# Altium schematic sheet Sheet1.SchDoc
size A4; SheetNumber: 1; SheetTotal: 1
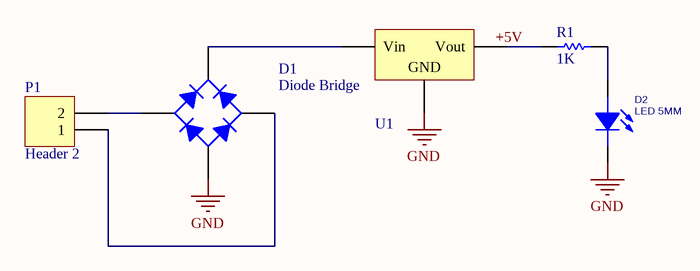
[diagram p0: Sheet1.SchDoc]

## Parts
D1  Diode Bridge  [Bridge KBP PACKAGE]
D2  LED 5MM  [LED5MM_BLUE]
P1  Header 2  [HDR1X2]
R1  1K  [Axial 0_25 W, 0_4 IN LEAD PITCH]
U1  L7805CV  [TO-220 AB]  (value not drawn)

## Nets
GND: D1.4(-) D2.2(CATHODE) U1.2(GND)
+5V: R1.2 U1.3(Vout)
NetD1_1: D1.1(+) U1.1(Vin)
NetD1_2: D1.2(AC) P1.2
NetD1_3: D1.3(AC) P1.1
NetD2_1: D2.1(ANODE) R1.1

## Library data of the parts
D1 = Diode Bridge TOTAL SIZE: Full Wave Diode Bridge; Designer: Abbas Basereh; Design Date: 1395/11/09; ComponentLink1Description: Datasheet; ComponentLink2Description: Reference; Mounting Technology: Surface Mount\Through-Hole; Status: Unreleased
D2 = LED 5MM: Light Emitting Diode; Designer: Abbas Basereh; Data: 16-12-2016; Link: *; Part.No: *
P1 = Header 2: Header, 2-Pin; LatestRevisionDate: 17-Jul-2002; LatestRevisionNote: Re-released for DXP Platform.; Publisher: Altium Limited
R1 = RES Axial 0.25W: Designer: Abbas Basereh; Desc.: RES Axial 0.25W; Data: 4-1-2017
U1 = L7805CV-Linear Voltage Regulator IC Positive 1 Output 5V 1.5A TO-220AB: Linear Voltage Regulator IC Positive FIXED; Manufacturer: STMicroelectronics; Designer: Abbas Basereh; Link: https://www.aliexpress.com/item/; Link: http://www.tme.eu/en/; Link: http://www.digikey.com/; Part. No: L7805CV